# Altium schematic sheet LDO_C.SchDoc
size B; Organization: Altium Limited; Address1: L3, 12a Rodborough Rd; Address2: Frenchs Forest; Address3: NSW; Address4: Australia 2086
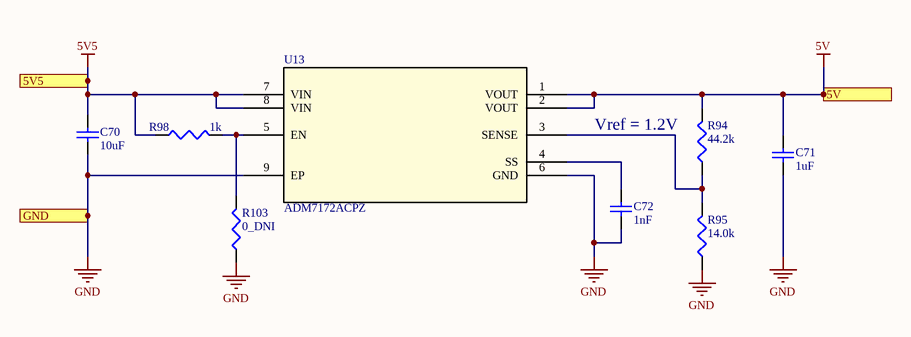
[diagram p0: LDO_C.SchDoc]

## Parts
C70  10uF  [SMD-0603]
C71  1uF  [SMD-0603]
C72  1nF  [SMD-0603]
R94  44.2k  [SMD-0603]
R95  14.0k  [SMD-0603]
R98  1k  [SMD-0603]
R103  0_DNI  [SMD-0603]
U13  ADM7172ACPZ  [LFCSP_WD-8]

## Ports
5V, 5V5, GND

## Nets
5V: C71.2 R94.2 U13.1(VOUT) U13.2(VOUT) ; port 5V
5V5: C70.2 R98.1 U13.7(VIN) U13.8(VIN) ; port 5V5
GND: C70.1 C71.1 C72.2 R95.1 R103.1 U13.6(GND) U13.9(EP) ; port GND
NetC72_1: C72.1 U13.4(SS)
NetR94_1: R94.1 R95.2 U13.3(SENSE)
NetR98_2: R98.2 R103.2 U13.5(EN)

## Notes on the sheet
- (near R94) Vref = 1.2V
- Title
- Size:
- Date:
- B
- Number:
- Time:
- Revision:
- Sheet
- of
- File:

## Library data of the parts
C70-C72 = CAP0603: Ceramic Capacitor 0603
R94 R95 R98 R103 = RES0603: Resistor-0603
U13 = ADM7172ACPZ: 6.5V, 2A, Ultralow Noise, High PSRR, Fast Transient Response CMOS LDO; Value: Value; Type: Type; RefDes: RefDes